# EAGLE design Snowman (EAGLE 7.5.0)
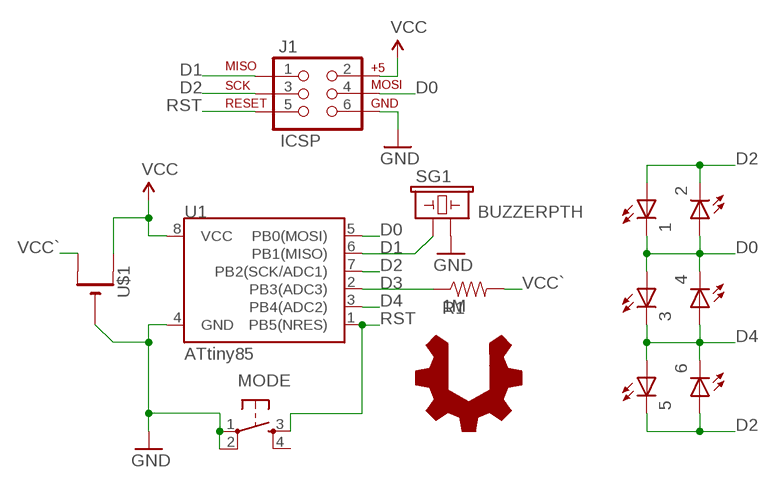
[diagram p0: schematic, sheet 1]

## Parts
1  LEDOVAL  [LED-OVAL]
2  LEDOVAL  [LED-OVAL]
3  LEDOVAL  [LED-OVAL]
4  LEDOVAL  [LED-OVAL]
5  LEDOVAL  [LED-OVAL]
6  LEDOVAL  [LED-OVAL]
J1  ICSP  AVR_SPI_PRG_6LABELED  [2X3-NS]
MODE  TAC_SWITCHPTH  [TACTILE-PTH]
R1  1M  RESISTORAXIAL-0.3  [AXIAL-0.3]
SG1  BUZZERPTH  [BUZZER-12MM]
U1  ATtiny85  ATTINY45TINY85-20-DIP  [DIP08]
U$1  CR2032THM  [CR2032-THRU]
U$2  USER_HACKABLE  [USER_HACKABLE]

## Nets
D0: 1.CATHODE(C) 2.ANODE(A) 3.ANODE(A) 4.CATHODE(C) J1.4(MOSI) U1.5(PB0(MOSI))
D1: J1.1(MISO) SG1.+ U1.6(PB1(MISO))
D2: 1.ANODE(A) 2.CATHODE(C) 5.CATHODE(C) 6.ANODE(A) J1.3(SCK) U1.7(PB2(SCK/ADC1))
D3: R1.P$1 U1.2(PB3(ADC3))
D4: 3.CATHODE(C) 4.ANODE(A) 5.ANODE(A) 6.CATHODE(C) U1.3(PB4(ADC2))
GND: J1.6(GND) MODE.1 MODE.2 SG1.- U1.4(GND) U$1.-
RST: J1.5(RST) MODE.3 U1.1(PB5(NRES))
VCC: J1.2(V+) U1.8(VCC) U$1.+1(+)
VCC`: R1.P$2 U$1.+2(+1)
Unconnected: MODE.4

## Library data of the parts
1-6 = barbary_enterprises:LED: LEDs Standard schematic elements and footprints for 5mm, 3mm, 1206, and 0603 sized LEDs. 5mm - Spark Fun Electronics SKU : COM-00529 (and others)
J1 = barbary_enterprises:AVR_SPI_PRG_6: AVR ISP 6 Pin This is the reduced ISP connector for AVR programming. Common on Arduino. This footprint will take up less PCB space and can be used with a 10-pin to 6-pin adapter such as SKU: BOB-08508
MODE = barbary_enterprises:TAC_SWITCH: Momentary Switch Button commonly used for reset or general input. Spark Fun Electronics SKU : COM-00097 SMT- SWCH-08247
R1 = barbary_enterprises:RESISTOR: Resistor Basic schematic elements and footprints for 0603, 1206, and PTH resistors.
SG1 = SparkFun-Electromechanical:BUZZER: Buzzer 12mm Spark Fun Electronics SKU : Comp-Buzzer
U1 = SparkFun-DigitalIC:ATTINY45: Atmel 8-pin 2/4/8kB flash uC; PROD_ID: IC-09445; VALUE: TINY85-20-DIP
U$1 = battery:CR2032
U$2 = logo:USER_HACKABLE

## Board
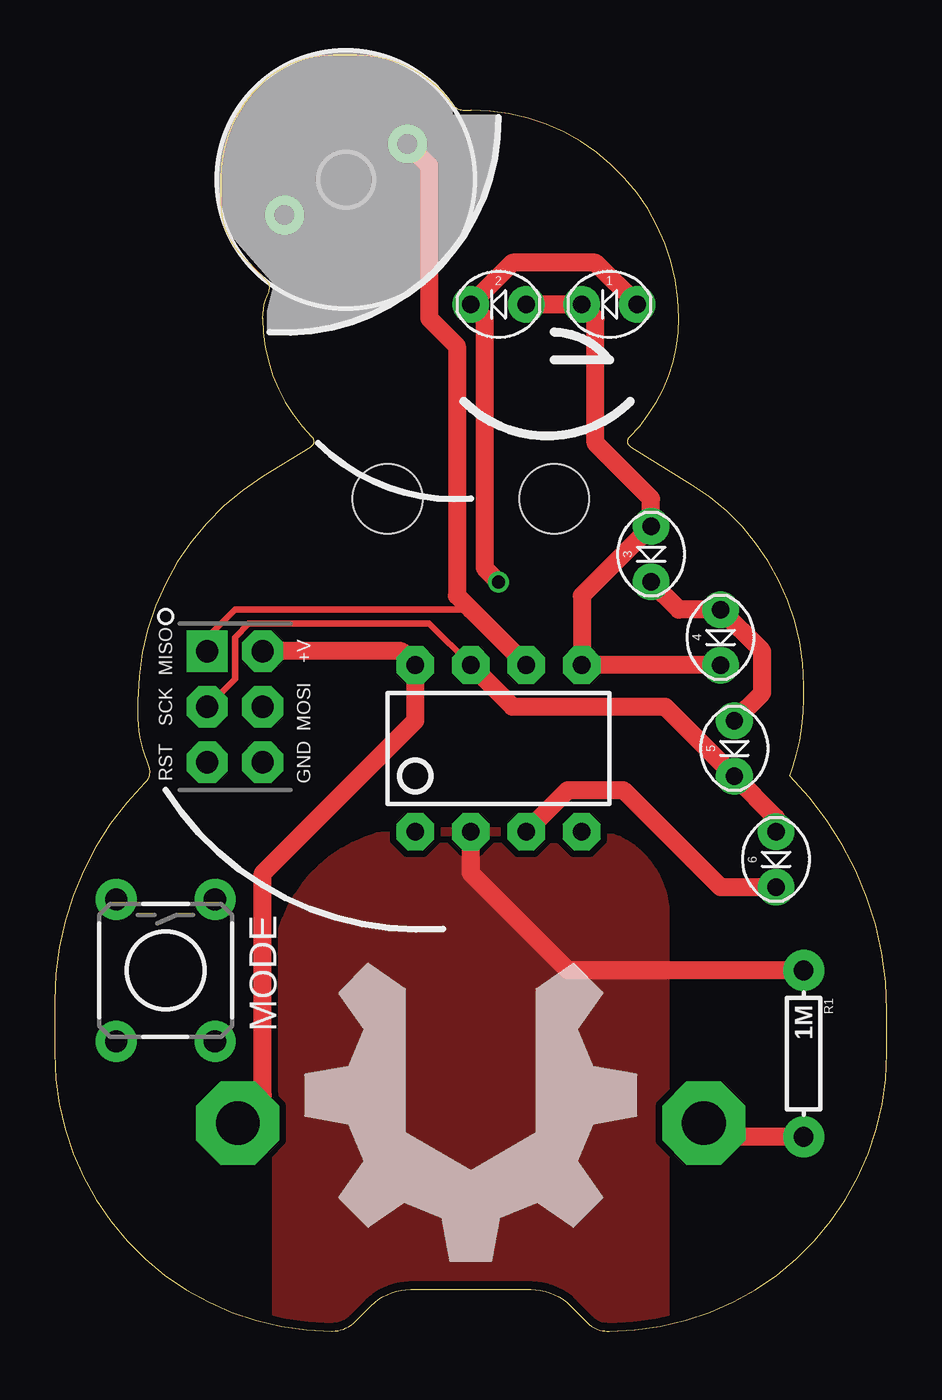
[diagram p1: board, top side]
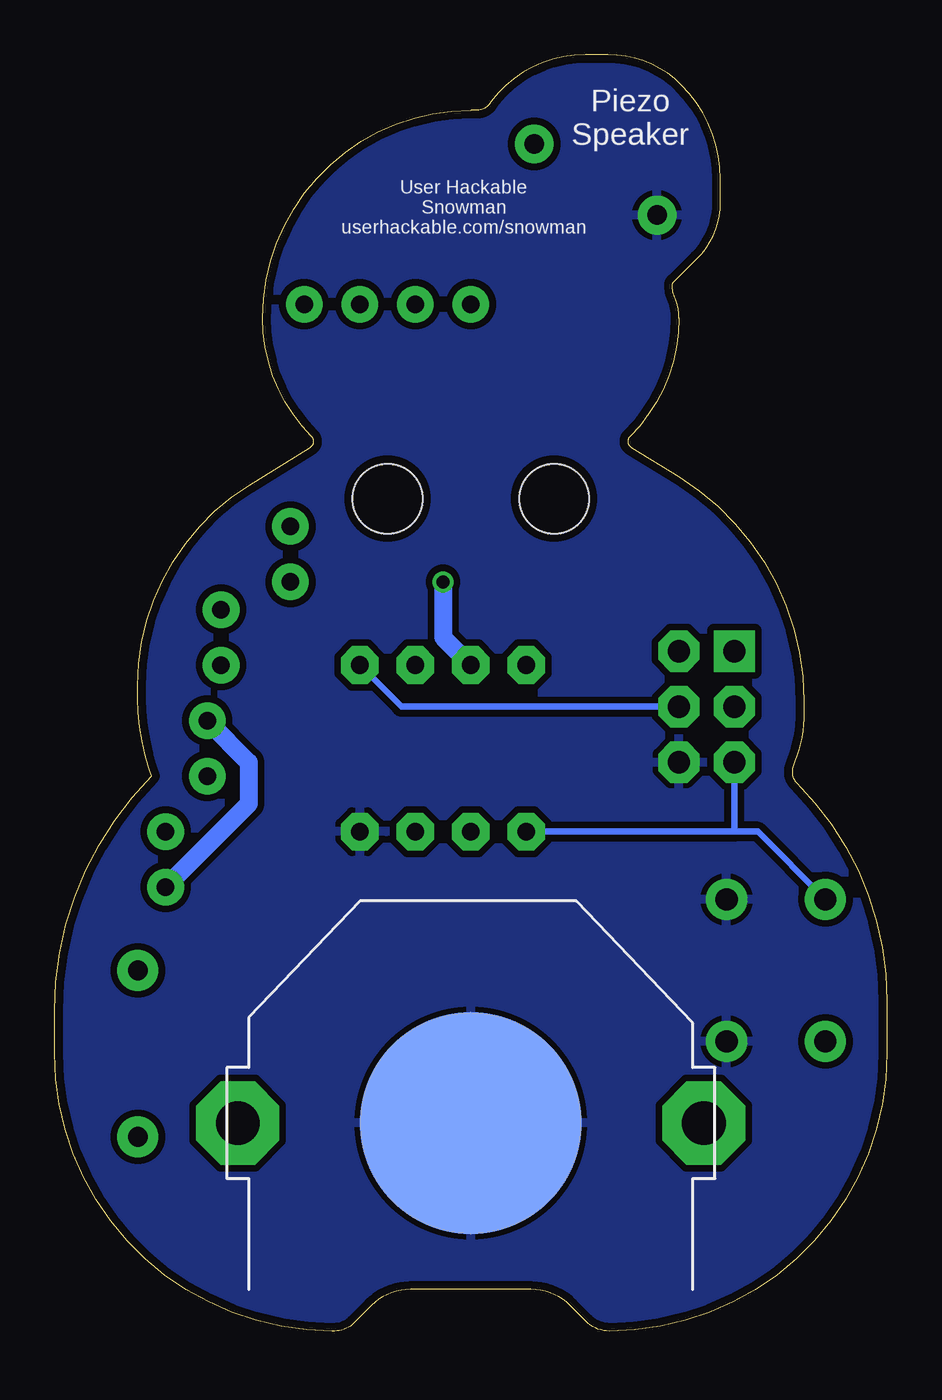
[diagram p2: board, bottom side, seen from below]

Size 38.1 x 58.42 mm. Coordinates in mm from the lower left corner, seen from the top.
Outline: 9.53,46.35 arc45 11.77,40.94 arc-107 11.7,40.44 9.52,39.1 arc58 3.81,28.84 3.81,28.03 arc18 4.04,26.62 4.3,25.82 arc-63 4.13,25.09 arc45 0,15.12 0,12.7 arc90 12.7,0 arc45 13.78,0.45 14.5,1.16 arc-45 16.29,1.91 21.81,1.91 arc-45 23.6,1.16 24.39,0.37 arc45 25.29,0 25.4,0 arc90 38.1,12.7 38.1,14.67 arc45 33.66,25.4 33.77,25.74 arc18 34.29,28.96 34.29,29.55 arc58 29.18,38.73 26.4,40.44 arc-107 26.33,40.94 arc45 28.57,46.35 arc90 19.05,55.88 18.73,55.88 arc-53 18.22,56.13 18.13,56.26 arc53 13.81,58.42 12.77,58.42 arc45 9.4,57.02 arc45 7.62,52.73 7.62,51.65 arc45 8.67,49.11 9.74,48.05 arc-50 9.83,47.8 9.81,47.56 arc27 9.53,46.35
Copper layers (1*16): Top 0.0356mm / dielectric 1.5011mm / Bottom 0.0356mm
Design rules "LaenPCBOrder": minimum track width 6mil, minimum drill 13mil, track to track 6mil, track to pad 6mil, pad to pad 6mil, via to via 6mil, smd to smd 6mil, copper to edge 15mil, drill to drill 6mil, minimum pad ring 7mil, minimum via ring 7mil, stop-mask expansion 3mil, vias tented up to drill 0mil, thermal gap 10mil
Holes 3.17 mm at 15.24,38.1 22.86,38.1

### Footprints (pad centres in the part's own frame; a part is rotated, then mirrored left to right if it is on the bottom)
LED-OVAL = drill 0.8 pad 1.676: ANODE 1.27,0; CATHODE -1.27,0
2X3-NS = drill 1.016 pad 1.88 square: 1 -2.54,-1.27 | drill 1.016 pad 1.88 octagon: 2 -2.54,1.27; 3 0,-1.27; 4 0,1.27; 5 2.54,-1.27; 6 2.54,1.27
TACTILE-PTH = drill 1.016 pad 1.88: 1 -3.251,2.261; 2 3.251,2.261; 3 -3.251,-2.261; 4 3.251,-2.261
AXIAL-0.3 = drill 0.9 pad 1.88: P$1 -3.81,0; P$2 3.81,0
BUZZER-12MM = drill 0.9 pad 1.778: + 3.25,0; - -3.25,0
DIP08 = drill 0.813 pad 1.727 octagon: 1 -3.81,-3.81; 2 -1.27,-3.81; 3 1.27,-3.81; 4 3.81,-3.81; 5 3.81,3.81; 6 1.27,3.81; 7 -1.27,3.81; 8 -3.81,3.81
CR2032-THRU = drill 2 pad 3.81 octagon: +1 -10.668,0; +2 10.668,0 | smd 10.16 x 10.16: - 0,0

### Placement (x,y rotation side)
1  25.4,46.99 0 top
2  20.32,46.99 0 top
3  27.3,35.56 90 top
4  30.48,31.75 90 top
5  31.11,26.67 90 top
6  33.02,21.59 90 top
J1  8.26,28.57 270 top
MODE  5.08,16.51 270 top
R1  34.29,12.7 270 top
SG1  13.34,52.7 30 top
U1  20.32,26.67 0 top
U$1  19.05,9.53 180 bottom
U$2  19.05,10.79 0 top

### Tracks (layer width: path | path; a pad name or v marks a point on that pad's centre or on a via)
D0
  Top 0.813: 4.CATHODE U1.5 24.13,33.66 3.ANODE 27.3,38.1 24.77,40.64 24.77,46.35 1.CATHODE 2.ANODE
  Bottom 0.305: U1.5 22.23,28.57 J1.4
D1
  Top 0.305: J1.1 6.99,31.75 8.26,33.02 19.05,33.02
  Top 0.813: U1.6 19.05,33.02 18.41,33.66 18.41,45.09 17.14,46.35 17.14,53.34 SG1.+
D2  (via drill 0.6)
  Top 0.305: J1.3 8.26,29.84 8.26,31.75 8.89,32.38 17.14,32.38 U1.7
  Top 0.813: 6.ANODE 33.02,23.5 5.CATHODE 27.94,28.57 20.95,28.57 U1.7 | 1.ANODE 24.77,48.9 20.95,48.9 2.CATHODE 19.68,46.35 19.68,34.92 v20.32,34.29
  Bottom 0.813: v20.32,34.29 20.32,31.75 U1.7
D3
  Top 0.813: R1.P$1 23.5,16.51 19.05,20.95 U1.2
  pour Top (isolate 0.305): 10.16,0 10.16,16.51 arc-90 16.51,22.86 24.13,22.86 arc-90 27.94,19.05 27.94,0
D4
  Top 0.813: U1.3 23.5,24.77 26.04,24.77 30.48,20.32 6.CATHODE | 5.ANODE 32.38,29.21 32.38,31.11 4.ANODE 28.57,33.02 3.CATHODE
  Bottom 0.813: 5.ANODE 29.21,26.04 29.21,24.13 6.CATHODE
GND
  pour Bottom (isolate 0.305): 0,0 38.1,0 38.1,55.88 13.34,59.69 0,59.69 0,55.88
RST
  Bottom 0.305: U1.1 6.99,22.86 | 6.99,22.86 J1.5 | MODE.3 5.92,22.86 6.99,22.86
VCC
  Top 0.813: U$1.+1 8.38,9.65 9.53,10.79 9.53,20.95 16.51,27.94 U1.8 15.88,31.11 J1.2
VCC`
  Top 0.813: R1.P$2 30.35,8.89 U$1.+2

### Text on the board
bPlace: Piezo / Speaker | User Hackable / Snowman / userhackable.com/snowman